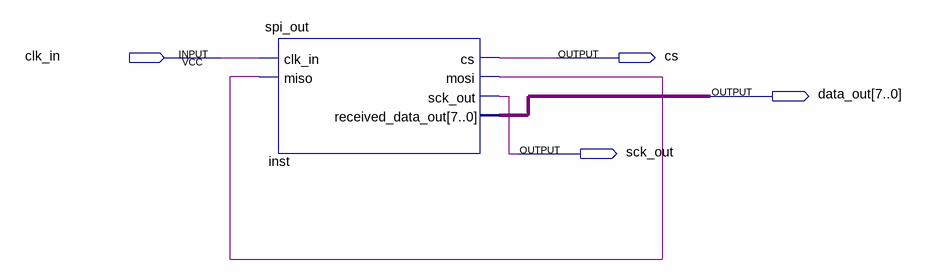
[diagram p0: schematic sheet]
// Quartus schematic spi.bdf as structural Verilog: 1 symbols, 4 pins
module spi (
  input  clk_in,
  output cs,
  output [7:0] data_out,
  output sck_out
);

  wire inst_mosi;

  spi_out inst (
    .clk_in(clk_in), .miso(inst_mosi), .cs(cs), .mosi(inst_mosi), .sck_out(sck_out),
    .received_data_out(data_out));
endmodule
